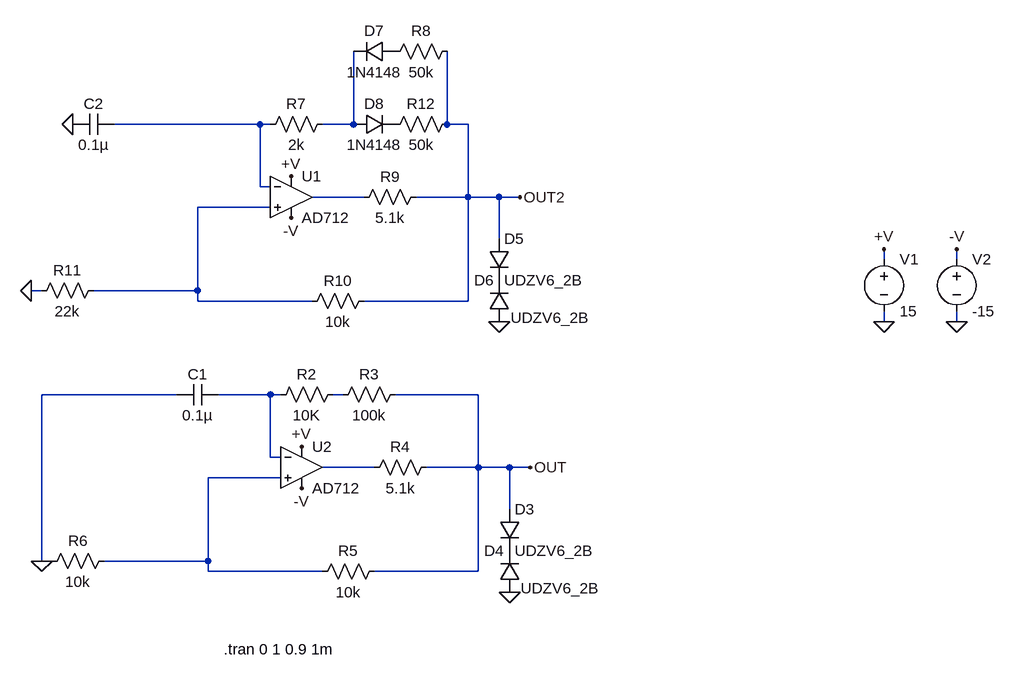
[diagram p0: schematic RectangularWaveGenerationCircuit.asc]
RectangularWaveGenerationCircuit.asc, the LTspice schematic file:
Version 4.1
SHEET 1 1364 1188
WIRE 224 -416 0 -416
WIRE 240 -416 224 -416
WIRE 368 -416 368 -528
WIRE 368 -416 320 -416
WIRE 512 -416 512 -528
WIRE 544 -416 512 -416
WIRE 224 -320 224 -416
WIRE 240 -320 224 -320
WIRE 384 -304 304 -304
WIRE 544 -304 544 -416
WIRE 544 -304 464 -304
WIRE 592 -304 544 -304
WIRE 624 -304 592 -304
WIRE 240 -288 128 -288
WIRE 592 -240 592 -304
WIRE 1184 -208 1184 -224
WIRE 1296 -208 1296 -224
WIRE -112 -160 -128 -160
WIRE 128 -160 128 -288
WIRE 128 -160 -32 -160
WIRE 128 -144 128 -160
WIRE 304 -144 128 -144
WIRE 544 -144 544 -304
WIRE 544 -144 384 -144
WIRE 1184 -112 1184 -128
WIRE 1296 -112 1296 -128
WIRE 96 0 -112 0
WIRE 240 0 160 0
WIRE 256 0 240 0
WIRE 352 0 336 0
WIRE 560 0 432 0
WIRE 240 96 240 0
WIRE 256 96 240 96
WIRE 400 112 320 112
WIRE 560 112 560 0
WIRE 560 112 480 112
WIRE 608 112 560 112
WIRE 640 112 608 112
WIRE 256 128 144 128
WIRE 608 176 608 112
WIRE -112 256 -112 0
WIRE -96 256 -112 256
WIRE 144 256 144 128
WIRE 144 256 -16 256
WIRE 144 272 144 256
WIRE 320 272 144 272
WIRE 560 272 560 112
WIRE 560 272 400 272
FLAG 1184 -224 +V
FLAG 1184 -112 0
FLAG 640 112 OUT
FLAG 288 80 +V
FLAG 1296 -224 -V
FLAG 288 144 -V
FLAG 1296 -112 0
FLAG -112 256 0
FLAG 608 304 0
FLAG 624 -304 OUT2
FLAG 272 -336 +V
FLAG 272 -272 -V
FLAG -128 -160 0
FLAG 592 -112 0
FLAG -64 -416 0
SYMBOL voltage 1184 -224 R0
WINDOW 123 0 0 Left 2
WINDOW 39 0 0 Left 2
SYMATTR InstName V1
SYMATTR Value 15
SYMBOL res 352 -16 R90
WINDOW 0 0 56 VBottom 2
WINDOW 3 32 56 VTop 2
SYMATTR InstName R2
SYMATTR Value 10K
SYMBOL voltage 1296 -224 R0
WINDOW 123 24 146 Left 2
WINDOW 39 24 125 Left 2
SYMATTR InstName V2
SYMATTR Value -15
SYMBOL AD712 288 48 R0
SYMATTR InstName U2
SYMBOL res 448 -16 R90
WINDOW 0 0 56 VBottom 2
WINDOW 3 32 56 VTop 2
SYMATTR InstName R3
SYMATTR Value 100k
SYMBOL res 496 96 R90
WINDOW 0 0 56 VBottom 2
WINDOW 3 32 56 VTop 2
SYMATTR InstName R4
SYMATTR Value 5.1k
SYMBOL res 416 256 R90
WINDOW 0 0 56 VBottom 2
WINDOW 3 32 56 VTop 2
SYMATTR InstName R5
SYMATTR Value 10k
SYMBOL res 0 240 R90
WINDOW 0 0 56 VBottom 2
WINDOW 3 32 56 VTop 2
SYMATTR InstName R6
SYMATTR Value 10k
SYMBOL cap 160 -16 R90
WINDOW 0 0 32 VBottom 2
WINDOW 3 32 32 VTop 2
SYMATTR InstName C1
SYMATTR Value 0.1µ
SYMBOL diode 592 176 R0
SYMATTR InstName D3
SYMATTR Value UDZV6_2B
SYMBOL diode 624 304 R180
WINDOW 0 24 64 Left 2
WINDOW 3 -123 6 Left 2
SYMATTR InstName D4
SYMATTR Value UDZV6_2B
SYMBOL AD712 272 -368 R0
SYMATTR InstName U1
SYMBOL res 480 -320 R90
WINDOW 0 0 56 VBottom 2
WINDOW 3 32 56 VTop 2
SYMATTR InstName R9
SYMATTR Value 5.1k
SYMBOL res 400 -160 R90
WINDOW 0 0 56 VBottom 2
WINDOW 3 32 56 VTop 2
SYMATTR InstName R10
SYMATTR Value 10k
SYMBOL res -16 -176 R90
WINDOW 0 0 56 VBottom 2
WINDOW 3 32 56 VTop 2
SYMATTR InstName R11
SYMATTR Value 22k
SYMBOL cap 0 -432 R90
WINDOW 0 0 32 VBottom 2
WINDOW 3 32 32 VTop 2
SYMATTR InstName C2
SYMATTR Value 0.1µ
SYMBOL diode 576 -240 R0
SYMATTR InstName D5
SYMATTR Value UDZV6_2B
SYMBOL diode 608 -112 R180
WINDOW 0 24 64 Left 2
WINDOW 3 -123 6 Left 2
SYMATTR InstName D6
SYMATTR Value UDZV6_2B
SYMBOL diode 432 -544 R90
WINDOW 0 0 32 VBottom 2
WINDOW 3 32 32 VTop 2
SYMATTR InstName D7
SYMATTR Value 1N4148
SYMBOL diode 368 -400 R270
WINDOW 0 32 32 VTop 2
WINDOW 3 0 32 VBottom 2
SYMATTR InstName D8
SYMATTR Value 1N4148
SYMBOL res 336 -432 R90
WINDOW 0 0 56 VBottom 2
WINDOW 3 32 56 VTop 2
SYMATTR InstName R7
SYMATTR Value 2k
SYMBOL res 528 -544 R90
WINDOW 0 0 56 VBottom 2
WINDOW 3 32 56 VTop 2
SYMATTR InstName R8
SYMATTR Value 50k
SYMBOL res 528 -432 R90
WINDOW 0 0 56 VBottom 2
WINDOW 3 32 56 VTop 2
SYMATTR InstName R12
SYMATTR Value 50k
TEXT 168 392 Left 2 !.tran 0 1 0.9 1m

The netlist it stands for:
* RectangularWaveGenerationCircuit.asc
V1 +V 0 15
R2 N006 N005 10K
V2 -V 0 -15
* U2: AD712 (symbol AD712 not available, pins judged from their places): In+=N008 In-=N005 V+=+V V-=-V OUT=N007
R3 OUT N006 100k
R4 OUT N007 5.1k
R5 OUT N008 10k
R6 N008 0 10k
C1 N005 0 0.1µ
D3 OUT P001 UDZV6_2B
D4 0 P001 UDZV6_2B
* U1: AD712 (symbol AD712 not available, pins judged from their places): In+=N004 In-=N001 V+=+V V-=-V OUT=N003
R9 OUT2 N003 5.1k
R10 OUT2 N004 10k
R11 N004 0 22k
C2 N001 0 0.1µ
D5 OUT2 P002 UDZV6_2B
D6 0 P002 UDZV6_2B
D7 P003 N002 1N4148
D8 N002 P004 1N4148
R7 N002 N001 2k
R8 OUT2 P003 50k
R12 OUT2 P004 50k
.model D D
.lib standard.dio
.tran 0 1 0.9 1m
.backanno
.end